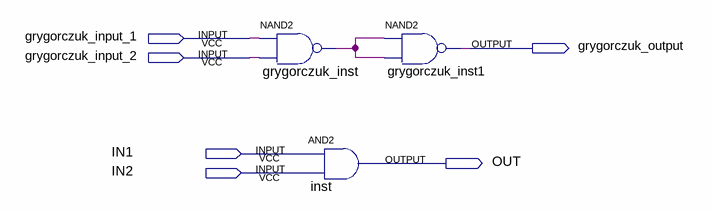
[diagram p0: schematic sheet]
// Quartus schematic AND_GATES.bdf as structural Verilog: 3 symbols, 6 pins
module AND_GATES (
  input  grygorczuk_input_1,
  input  grygorczuk_input_2,
  input  IN1,
  input  IN2,
  output grygorczuk_output,
  output OUT
);

  wire grygorczuk_inst_out;

  nand grygorczuk_inst (grygorczuk_inst_out, grygorczuk_input_1, grygorczuk_input_2);
  and inst (OUT, IN1, IN2);
  nand grygorczuk_inst1 (grygorczuk_output, grygorczuk_inst_out, grygorczuk_inst_out);
endmodule
